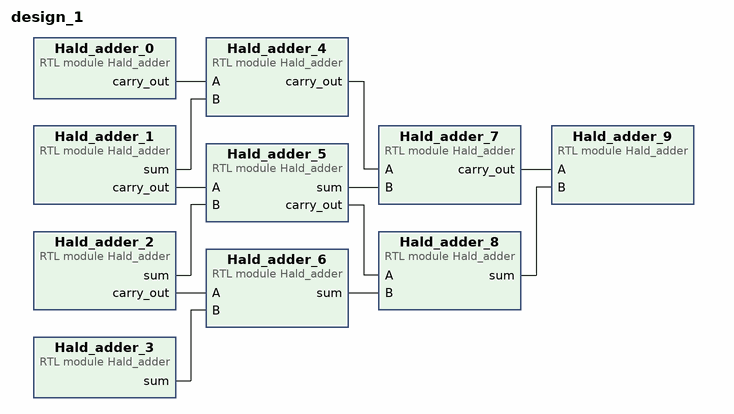
[diagram p0: block diagram of the top level]
# Vivado block design design_1, xc7a100tcsg324-1, Vivado 2024.2
create_bd_design design_1

create_bd_cell -type module -reference Hald_adder Hald_adder_0
create_bd_cell -type module -reference Hald_adder Hald_adder_1
create_bd_cell -type module -reference Hald_adder Hald_adder_2
create_bd_cell -type module -reference Hald_adder Hald_adder_3
create_bd_cell -type module -reference Hald_adder Hald_adder_4
create_bd_cell -type module -reference Hald_adder Hald_adder_5
create_bd_cell -type module -reference Hald_adder Hald_adder_6
create_bd_cell -type module -reference Hald_adder Hald_adder_7
create_bd_cell -type module -reference Hald_adder Hald_adder_8
create_bd_cell -type module -reference Hald_adder Hald_adder_9

# ---- connections ----

connect_bd_net [get_bd_pins Hald_adder_0/carry_out] [get_bd_pins Hald_adder_4/A]
connect_bd_net [get_bd_pins Hald_adder_1/carry_out] [get_bd_pins Hald_adder_5/A]
connect_bd_net [get_bd_pins Hald_adder_1/sum] [get_bd_pins Hald_adder_4/B]
connect_bd_net [get_bd_pins Hald_adder_2/carry_out] [get_bd_pins Hald_adder_6/A]
connect_bd_net [get_bd_pins Hald_adder_2/sum] [get_bd_pins Hald_adder_5/B]
connect_bd_net [get_bd_pins Hald_adder_3/sum] [get_bd_pins Hald_adder_6/B]
connect_bd_net [get_bd_pins Hald_adder_4/carry_out] [get_bd_pins Hald_adder_7/A]
connect_bd_net [get_bd_pins Hald_adder_5/carry_out] [get_bd_pins Hald_adder_8/A]
connect_bd_net [get_bd_pins Hald_adder_5/sum] [get_bd_pins Hald_adder_7/B]
connect_bd_net [get_bd_pins Hald_adder_6/sum] [get_bd_pins Hald_adder_8/B]
connect_bd_net [get_bd_pins Hald_adder_7/carry_out] [get_bd_pins Hald_adder_9/A]
connect_bd_net [get_bd_pins Hald_adder_8/sum] [get_bd_pins Hald_adder_9/B]

validate_bd_design
save_bd_design
